# EasyEDA Pro project ProPrj_super_cap_ctrl_v1.0_2025-02-24.epro, board PCB1
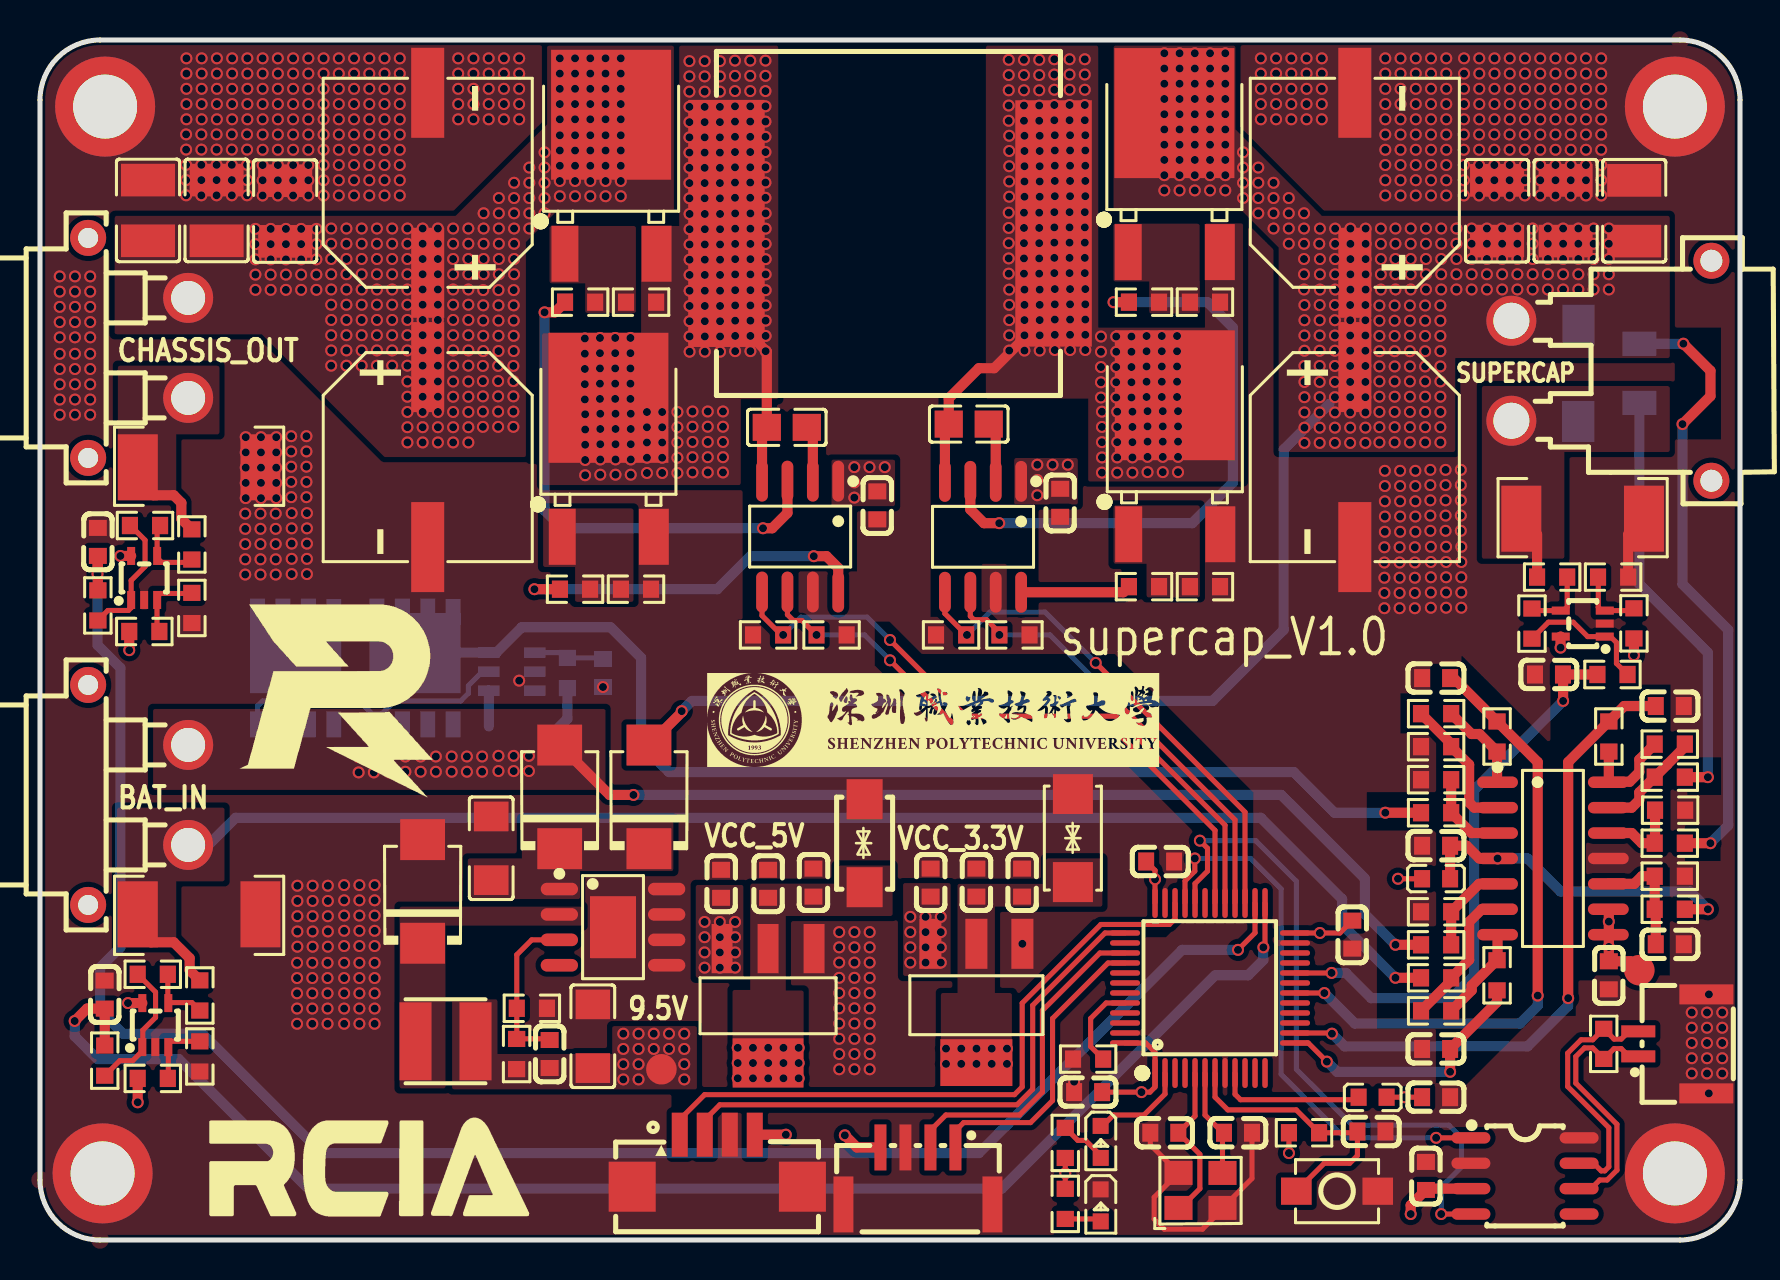
[diagram p8: board, top side]
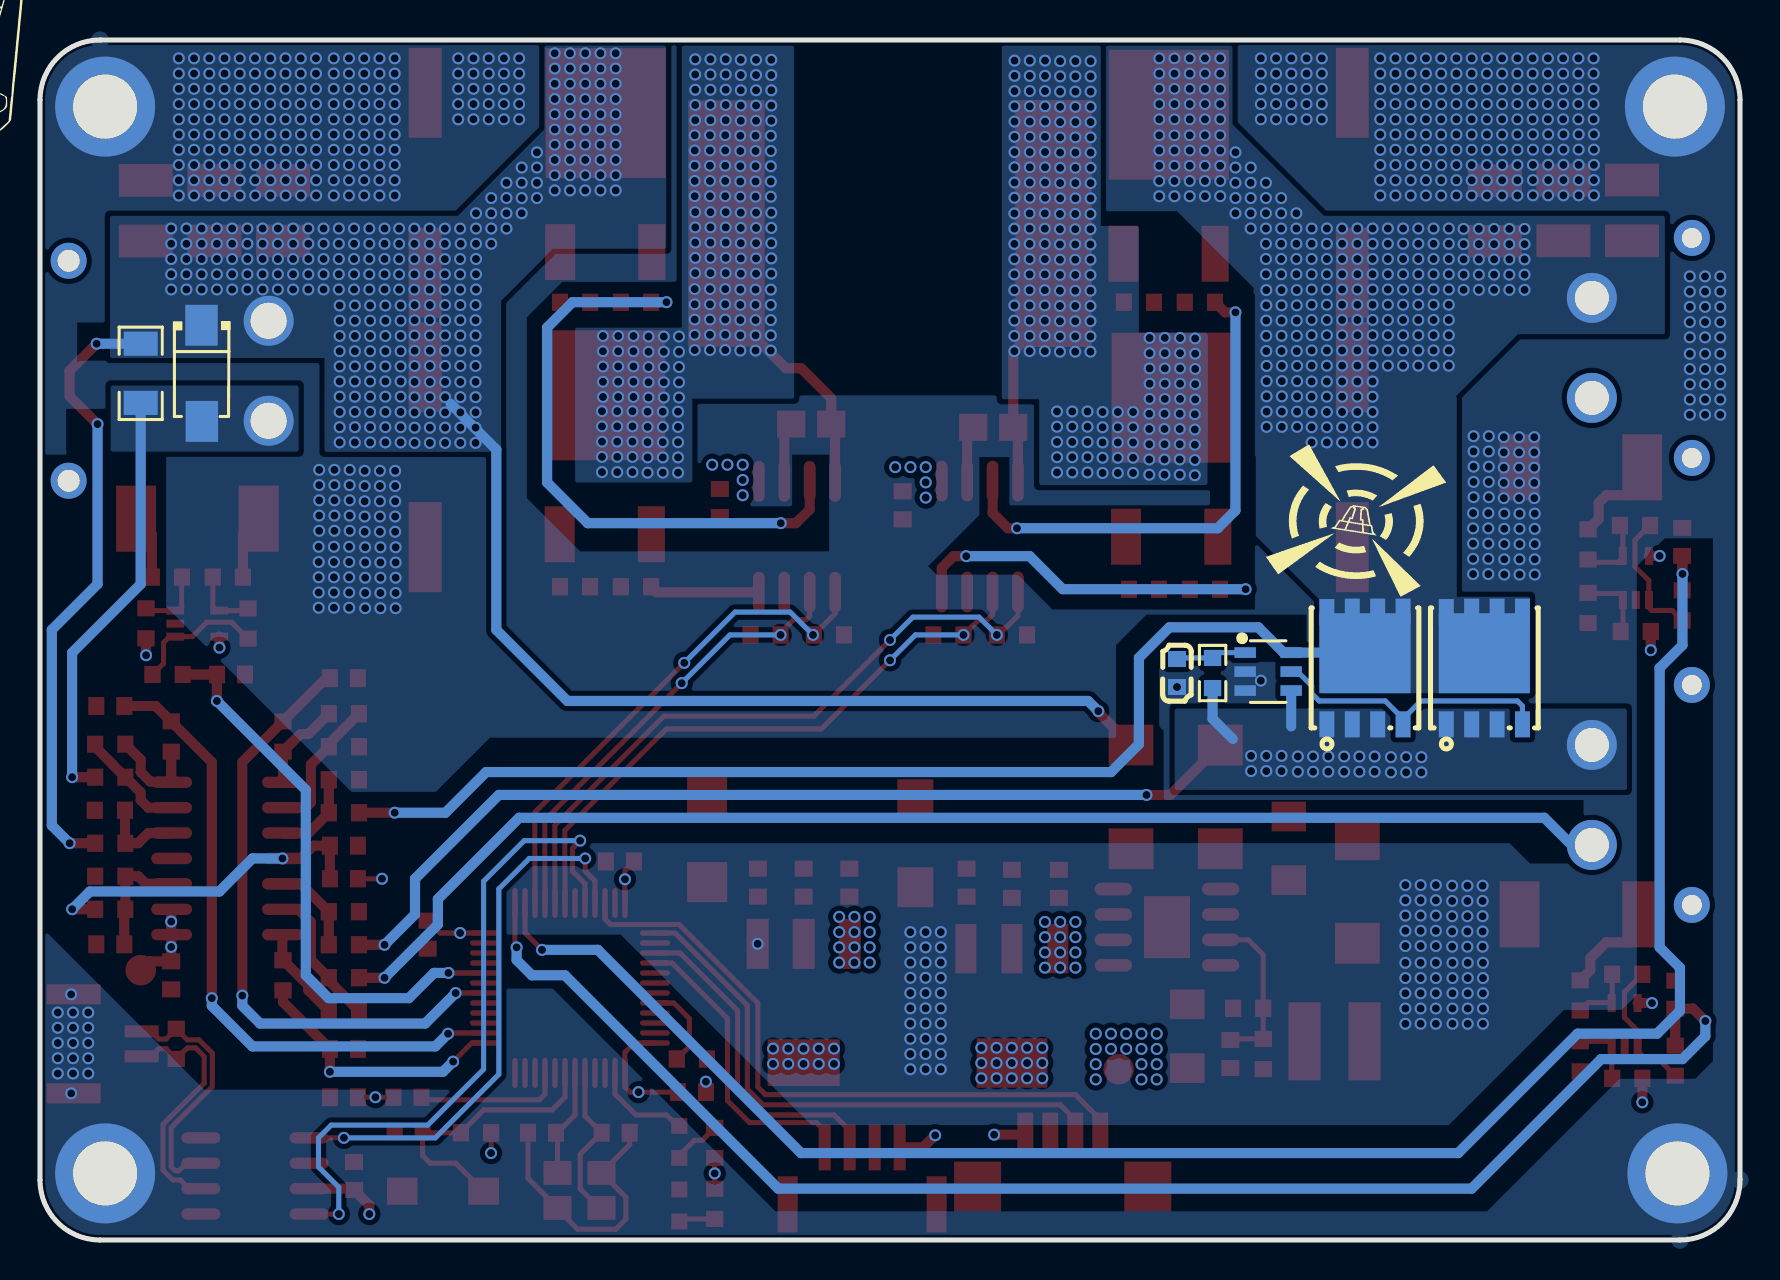
[diagram p9: board, bottom side, seen from below]

Outline 85 x 60 mm; copper layers: Top Layer, GND, VCC, Bottom Layer. Coordinates in mm from the lower left corner of the outline.
Outline path: 0,57 arc(0.88,59.12) 3,60 82,60 arc(84.12,59.12) 85,57 85,3 arc(84.12,0.88) 82,0 3,0 arc(0.88,0.88) 0,3 0,57
Stack: Top Layer 0.035mm 外层铜厚1oz / Dielectric1 0.2104mm 7628 RC49% 8.6mil / GND 0.0152mm 内层铜厚 / Dielectric2 1.065mm 1.1mm H/HOZ 含铜 / VCC 0.0152mm 内层铜厚 / Dielectric3 0.2104mm 7628 RC49% 8.6mil / Bottom Layer 0.035mm 外层铜厚1oz

## Design rules (mm)
net CAN-H: DP1
net CAN-L: DP1
template: 自定义配置
spacing copperThickness1oz (default): track to track 0.102, other pairs 0.076 to 0.3
spacing copperThickness2oz: track to track 0.203, other pairs 0.152 to 0.3
track width copperThickness1oz (default): min 0.127, default 0.254, max 2.54
track width copperThickness2oz: min 0.203, default 0.254, max 2.54
differential pair differentialPair (default): width min 0.127, default 0.254, max 2.54; gap min 0.152, default 0.152
via viaSize (default): diameter min 0.399, default 0.599, max 10; hole min 0.249, default 0.399, max 6.299

## Placement (name value [footprint] x y rotation side)
C1  10uF  [C0603]  41.87 36.73 90 top
C2  1uF  [C0805]  37.34 40.63 0 top
C3  150uF  [CAP-SMD_BD10.0-L10.3-W10.3-LS11.3-FD]  19.39 39.14 270 top
C4  150uF  [CAP-SMD_BD10.0-L10.3-W10.3-LS11.3-FD]  19.39 52.86 90 top
C7  47uF  [C1210]  12.26 51.45 270 top
C8  47uF  [C1210]  8.83 51.48 270 top
C9  47uF  [C1210]  5.4 51.48 270 top
C10  150uF  [CAP-SMD_BD10.0-L10.3-W10.3-LS11.3-FD]  65.74 39.14 270 top
C11  150uF  [CAP-SMD_BD10.0-L10.3-W10.3-LS11.3-FD]  65.74 52.86 90 top
C12  47uF  [C1210]  72.85 51.46 270 top
C13  47uF  [C1210]  76.28 51.46 270 top
C14  47uF  [C1210]  79.71 51.46 270 top
C15  10uF  [C0603]  51.01 36.86 90 top
C16  1uF  [C0805]  46.44 40.8 0 top
C17  22pF  [C0603]  56.22 5.36 180 top
C18  22pF  [C0603]  59.9 5.36 0 top
C19  100nF  [C0603]  66.57 5.42 0 top
C54  100nF  [C0603]  69.3 3.2 90 top
C170  100nF  [C0603]  52.41 7.39 0 top
C171  100nF  [C0603]  56.01 18.93 180 top
C174  100nF  [C0603]  65.61 15.27 90 top
C175  100nF  [C0603]  69.81 7.14 0 top
C176  100nF  [C0603]  69.81 19.71 0 top
C177  10nF  [C0603]  2.89 34.9 270 top
C178  10nF  [C0603]  69.81 28.1 0 top
C179  10nF  [C0603]  81.49 26.7 180 top
C180  100nF  [C0603]  81.49 14.79 180 top
C181  100nF  [C0603]  78.44 13.24 90 top
C182  10nF  [C0603]  75.45 28.28 0 top
C184  10nF  [C0603]  3.24 12.27 270 top
C185  10uF  [C1206]  22.56 19.59 90 top
C186  100nF  [C0603]  36.4 17.81 270 top
C187  47uF  [C1206]  27.64 10.19 270 top
C188  100nF  [C0603]  34.06 17.81 270 top
C189  100nF  [C0603]  44.53 17.87 270 top
C190  10uF  [C0603]  38.67 17.87 270 top
C191  100nF  [C0603]  46.82 17.87 270 top
C192  10uF  [C0603]  49.1 17.87 270 top
C194  10nF  [C0603]  69.81 9.55 0 top
C195  100nF  [C0603]  28.15 28.35 90 bottom
CN1  HC-1.25-4PWT  [CONN-SMD_4P-P1.25-HC-1.25-4PWT]  33.86 3.97 0 top
CN2  XT30PW-M  [CONN-TH_XT30PW-M]  78.57 43.46 90 top
D1  SS510  [SMB_L4.3-W3.6-LS5.4-RD]  19.13 17.43 90 top
D2  SMAJ5.0CA  [SMA_L4.4-W2.8-LS5.1-BI]  41.23 19.84 270 top
D3  SMAJ3.3CA  [SMA_L4.3-W2.6-LS5.1-BI]  51.64 20.09 270 top
D4  SMAJ75A  [SMA_L4.3-W2.6-LS5.0-RD]  76.92 43.34 270 bottom
D5  SS510  [SMB_L4.3-W3.6-LS5.4-RD]  25.98 22.16 90 top
D6  SS510  [SMB_L4.3-W3.6-LS5.4-RD]  30.45 22.16 90 top
L1  22uH  [IND-SMD_L17.2-W17.2]  42.5 50.83 0 top
L2  10uH  [L0603]  66.63 7.14 180 top
L3  10uH  [L0603]  69.81 18.06 0 top
L4  100uH  [IND-SMD_L4.0-W4.0_FNR40XXS]  20.28 9.93 180 top
LED1  -  [LED_0603]  53.04 4.85 270 top
LED2  -  [LED_0603]  53.04 1.68 270 top
NOREF  -  [Pad_ie150]  3.13 3.33 0 top
NOREF#2  -  [Pad_e1701]  79.97 13.49 0 top
NOREF#3  -  [Pad_ie149]  81.74 3.33 0 top
NOREF#4  -  [Pad_e11324]  31.07 8.54 0 top
NOREF#5  -  [Pad_ie148]  81.74 56.67 0 top
NOREF#6  -  [Pad_ie145]  3.26 56.67 0 top
Q1  NCEP0178AK  [TO-252-2_L6.5-W6.1-P4.58-LS10.0-TL]  28.54 52.79 90 top
Q2  NCEP0178AK  [TO-252-2_L6.5-W6.1-P4.58-LS10.0-TL]  28.4 38.64 90 top
Q3  NCEP0178AK  [TO-252-2_L6.5-W6.1-P4.58-LS10.0-TL]  56.7 52.87 90 top
Q4  NCEP0178AK  [TO-252-2_L6.5-W6.1-P4.58-LS10.0-TL]  56.72 38.76 90 top
Q7  BSC030N08NS5  [PG-TDSON-8_L5.0-W6.0-P1.27-BL-EP]  12.78 28.6 180 bottom
Q8  BSC030N08NS5  [PG-TDSON-8_L5.0-W6.0-P1.27-BL-EP]  18.75 28.6 180 bottom
R1  10K  [R0603]  30.05 46.89 180 top
R2  4.7R  [R0603]  27.01 46.89 180 top
R3  10K  [R0603]  29.8 32.54 180 top
R4  4.7R  [R0603]  26.75 32.54 180 top
R5  10K  [R0603]  58.25 46.89 180 top
R6  4.7R  [R0603]  55.2 46.89 180 top
R7  10K  [R0603]  58.25 32.67 180 top
R8  4.7R  [R0603]  55.2 32.67 180 top
R9  10K  [R0603]  39.58 30.25 180 top
R10  10K  [R0603]  36.4 30.25 0 top
R11  10K  [R0603]  48.72 30.25 180 top
R12  10K  [R0603]  45.55 30.25 0 top
R13  10K  [R0603]  63.2 5.36 180 top
R14  10K  [R0603]  51.26 1.81 270 top
R15  10K  [R0603]  51.26 4.85 90 top
R16  10K  [R0603]  52.41 9.05 0 top
R108  1K  [R0603]  7.59 31.6 90 top
R109  1K  [R0603]  7.59 34.78 270 top
R110  1K  [R0603]  2.89 31.73 90 top
R111  7.5k  [R0603]  5.25 35.72 180 top
R112  7.5K  [R0603]  5.21 30.43 180 top
R113  15K  [R0603]  69.81 21.36 0 top
R114  15K  [R0603]  69.81 24.67 0 top
R115  1K  [R0603]  69.81 23.02 180 top
R116  1K  [R0603]  69.81 26.32 180 top
R117  1K  [R0603]  72.85 25.17 270 top
R118  15K  [R0603]  81.49 19.84 180 top
R119  15K  [R0603]  81.49 23.14 180 top
R120  1K  [R0603]  81.5 21.49 0 top
R121  1K  [R0603]  81.49 24.79 0 top
R122  1K  [R0603]  78.44 25.17 270 top
R123  10K  [R0603]  81.49 16.54 180 top
R124  10K  [R0603]  81.49 18.19 180 top
R125  1K  [R0603]  78.66 33.15 180 top
R126  1K  [R0603]  75.61 33.15 0 top
R127  13.3K  [R0603]  78.62 28.28 180 top
R128  7.5k  [R0603]  74.6 30.82 270 top
R129  7.5K  [R0603]  79.7 30.83 270 top
R135  1K  [R0603]  7.99 9.18 90 top
R136  1K  [R0603]  7.99 12.23 270 top
R137  13.3K  [R0603]  3.24 8.97 90 top
R138  7.5k  [R0603]  5.64 13.29 180 top
R139  7.5K  [R0603]  5.64 8.08 180 top
R140  30K  [R0603]  23.83 9.3 270 top
R141  4.7K  [R0603]  24.59 11.59 180 top
R145  1K  [R0603]  69.81 16.41 0 top
R146  15K  [R0603]  69.81 14.76 0 top
R147  15K  [R0603]  69.81 13.11 0 top
R148  1K  [R0603]  69.81 11.46 0 top
R149  1K  [R0603]  72.85 13.24 270 top
R150  120R  [R0603]  78.19 9.81 90 top
R151  10mΩ  [RES-SMD_L6.4-W3.2-R2512]  77.13 36.07 0 top
R152  20K  [R1206]  79.97 43.34 90 bottom
R153  10mΩ  [RES-SMD_L6.4-W3.2-R2512]  7.96 38.64 0 top
R154  47R  [R0603]  26.37 28.35 270 bottom
R155  10mΩ  [RES-SMD_L6.4-W3.2-R2512]  7.96 16.28 180 top
SW1  轻触按键3*4*H  [SW-SMD_L4.0-W2.9-LS5.0]  64.85 2.44 180 top
U2  UCC27211D  [SOIC-8_L4.9-W3.9-P1.27-LS6.0-BL]  38.01 35.17 180 top
U3  UCC27211D  [SOIC-8_L4.9-W3.9-P1.27-LS6.0-BL]  47.15 35.16 180 top
U4  STM32F334C8T6  [LQFP-48_L7.0-W7.0-P0.50-LS9.0-BL]  58.5 12.6 0 top
U5  GH1.25-4P卧贴  [CONN-SMD_4P-P1.25_GH1.25-4P]  43.9 3.2 0 top
U10  -  [SOIC-8_L5.0-W4.0-P1.27-LS6.0-BL]  74.25 3.2 270 top
U11  GH1.25-2P卧贴  [CONN-SMD_2P-P1.25_GH1.25-2P]  81.62 9.81 90 top
U18  XL7005A  [SOIC-8_L4.9-W3.9-P1.27-LS6.0-BL-EP3.1-1]  28.65 15.64 270 top
U19  33nF  [C0603]  25.48 9.3 270 top
U20  AMS1117-5.0  [SOT-223_L6.5-W3.5-P2.30-LS7.0-BR]  36.4 11.71 90 top
U21  AMS1117-3.3  [SOT-223-3_L6.5-W3.4-P2.30-LS7.0-BR]  46.82 11.84 90 top
U25  TLV521DCKR  [SC-70-5_L2.1-W1.3-P0.65-LS2.1-BR]  77.14 30.82 0 top
U26  TLV521DCKR  [SC-70-5_L2.1-W1.3-P0.65-LS2.1-BR]  5.77 10.75 270 top
U27  TLV521DCKR  [SC-70-5_L2.1-W1.3-P0.65-LS2.1-BR]  5.21 33.1 270 top
U30  LM5050Q0MK-1/NOPB  [SOT-23-6_L2.9-W1.6-P0.95-LS2.8-BL]  23.59 28.42 270 bottom
U31  TLV2374MDREP  [SOIC-14_L8.7-W3.9-P1.27-LS6.0-BL]  75.65 19.08 270 top
U32  XT30PW-F  [CONN-TH_XT30PW-F-1]  4.91 22.25 270 top
U33  XT30PW-F  [CONN-TH_XT30PW-F-1]  4.91 44.61 270 top
X2  8MHz  [OSC-SMD_4P-L3.2-W2.5-BL]  58.02 2.48 0 top

## Footprints (pads in the part's own frame, mm; a bottom-side part is the same pattern mirrored in y, then rotated)
C0603
  rect 0.8x0.9 smd: 1(-0.7,0) 2(0.7,0)
C0805
  rect 1.41x1.35 smd: 1(-1,0) 2(1,0)
C1206
  rect 1.485x1.728 smd: 1(-1.593,0) 2(1.593,0)
C1210
  rect 1.635x2.7 smd: 1(-1.518,0) 2(1.518,0)
CAP-SMD_BD10.0-L10.3-W10.3-LS11.3-FD
  rect 4.5x1.65 smd: 1(-4.5,0) 2(4.5,0)
CONN-SMD_2P-P1.25_GH1.25-2P
  rect 0.6x1.7 smd: 1(-0.625,1.702) 2(0.625,1.702)
  rect 1x2.7 smd: 3(2.475,-1.702) 4(-2.475,-1.698)
CONN-SMD_4P-P1.25-HC-1.25-4PWT
  rect 0.8x2.2 smd: 1(-1.875,1.3) 2(-0.625,1.3) 3(0.625,1.3) 4(1.875,1.3)
  rect 2.35x2.5 smd: 5(4.255,-1.3) 6(-4.255,-1.3)
CONN-SMD_4P-P1.25_GH1.25-4P
  rect 0.6x2.3 smd: 1(1.875,1.425) 2(0.625,1.425) 3(-0.625,1.425) 4(-1.875,1.425)
  rect 1x2.8 smd: 5(-3.725,-1.425) 6(3.725,-1.425)
CONN-TH_XT30PW-F-1
  round 2.5 hole 1.7: 1(-2.5,2.5) 2(2.5,2.5)
  round 1.8 hole 1: 3(5.5,-2.5) 4(-5.5,-2.5)
CONN-TH_XT30PW-M
  round 2.5 hole 1.8: 1(-2.5,5) 2(2.5,5)
  round 1.8 hole 1.1: 3(5.5,-5) 4(-5.5,-5)
IND-SMD_L4.0-W4.0_FNR40XXS
  rect 1.6x3.9 smd: 1(-1.5,0) 2(1.5,0)
IND-SMD_L17.2-W17.2
  rect 3.825x12.35 smd: 1(-8.178,0)
  rect 3.825x12.32 smd: 2(8.178,0)
L0603
  rect 0.8x0.864 smd: 1(-0.7,0) 2(0.7,0)
LED_0603
  rect 0.8x0.8 smd: 1(-0.851,-0.01) 2(0.75,-0.005)
LQFP-48_L7.0-W7.0-P0.50-LS9.0-BL
  oval 0.27x1.5 smd: 1(-2.75,-4.25) 2(-2.25,-4.25) 3(-1.75,-4.25) 4(-1.25,-4.25) 5(-0.75,-4.25) 6(-0.25,-4.25) 7(0.25,-4.25) 8(0.75,-4.25) 9(1.25,-4.25) 10(1.75,-4.25) 11(2.25,-4.25) 12(2.75,-4.25) 25(2.75,4.25) 26(2.25,4.25) 27(1.75,4.25) 28(1.25,4.25) 29(0.75,4.25) 30(0.25,4.25) 31(-0.25,4.25) 32(-0.75,4.25) 33(-1.25,4.25) 34(-1.75,4.25) 35(-2.25,4.25) 36(-2.75,4.25)
  oval 1.5x0.27 smd: 13(4.25,-2.75) 14(4.25,-2.25) 15(4.25,-1.75) 16(4.25,-1.25) 17(4.25,-0.75) 18(4.25,-0.25) 19(4.25,0.25) 20(4.25,0.75) 21(4.25,1.25) 22(4.25,1.75) 23(4.25,2.25) 24(4.25,2.75) 37(-4.25,2.75) 38(-4.25,2.25) 39(-4.25,1.75) 40(-4.25,1.25) 41(-4.25,0.75) 42(-4.25,0.25) 43(-4.25,-0.25) 44(-4.25,-0.75) 45(-4.25,-1.25) 46(-4.25,-1.75) 47(-4.25,-2.25) 48(-4.25,-2.75)
OSC-SMD_4P-L3.2-W2.5-BL
  rect 1.4x1.2 smd: 1(-1.1,-0.875) 2(1.1,-0.875) 3(1.1,0.875) 4(-1.1,0.875)
Pad_e1701
  round 1.524 smd: 49(0,0)
Pad_e11324
  round 1.524 smd: 49(0,0)
Pad_ie145
  round 5 hole 3.2: 10(0,0)
Pad_ie148
  round 5 hole 3.2: 10(0,0)
Pad_ie149
  round 5 hole 3.2: 10(0,0)
Pad_ie150
  round 5 hole 3.2: 10(0,0)
PG-TDSON-8_L5.0-W6.0-P1.27-BL-EP
  rect 0.75x1.3 smd: 1(-1.905,-2.82) 2(-0.635,-2.82) 3(0.635,-2.82) 4(1.905,-2.82) 5(1.905,2.82) 6(0.635,2.82) 7(-0.635,2.82) 8(-1.905,2.794)
  rect 4.56x4 smd: 8(0,0.737)
R0603
  rect 0.806x0.864 smd: 1(-0.753,0) 2(0.753,0)
R1206
  rect 1.208x1.701 smd: 1(-1.479,0) 2(1.479,0)
RES-SMD_L6.4-W3.2-R2512
  rect 2x3.3 smd: 1(-3.067,0) 2(3.067,0)
SC-70-5_L2.1-W1.3-P0.65-LS2.1-BR
  rect 0.9x0.4 smd: 1(1.1,-0.65) 2(1.1,0) 3(1.1,0.65) 4(-1.1,0.65) 5(-1.1,-0.65)
SMA_L4.3-W2.6-LS5.0-RD
  rect 2.046x1.62 smd: 1(-2.404,-0.009) 2(2.404,0.009)
SMA_L4.3-W2.6-LS5.1-BI
  rect 2x2 smd: 1(-2.2,0) 2(2.2,0)
SMA_L4.4-W2.8-LS5.1-BI
  rect 2x1.8 smd: 1(-2.2,0) 2(2.2,0)
SMB_L4.3-W3.6-LS5.4-RD
  rect 2.047x2.241 smd: 1(-2.591,0) 2(2.591,0)
SOIC-8_L4.9-W3.9-P1.27-LS6.0-BL
  oval 0.588x2.045 smd: 1(-1.905,-2.772) 2(-0.635,-2.772) 3(0.635,-2.772) 4(1.905,-2.772) 5(1.905,2.772) 6(0.635,2.772) 7(-0.635,2.772) 8(-1.905,2.772)
SOIC-8_L4.9-W3.9-P1.27-LS6.0-BL-EP3.1-1
  oval 0.63x1.865 smd: 1(-1.905,-2.683) 2(-0.635,-2.683) 3(0.635,-2.683) 4(1.905,-2.683) 5(1.905,2.683) 6(0.635,2.683) 7(-0.635,2.683) 8(-1.905,2.683)
  rect 3.1x2.3 smd: 9(0,0)
SOIC-8_L5.0-W4.0-P1.27-LS6.0-BL
  oval 0.569x1.95 smd: 1(-1.905,-2.705) 2(-0.635,-2.705) 3(0.635,-2.705) 4(1.905,-2.705) 5(1.905,2.705) 6(0.635,2.705) 7(-0.635,2.705) 8(-1.905,2.705)
SOIC-14_L8.7-W3.9-P1.27-LS6.0-BL
  oval 0.574x2.038 smd: 1(-3.81,-2.769) 2(-2.54,-2.769) 3(-1.27,-2.769) 4(0,-2.769) 5(1.27,-2.769) 6(2.54,-2.769) 7(3.81,-2.769) 8(3.81,2.769) 9(2.54,2.769) 10(1.27,2.769) 11(0,2.769) 12(-1.27,2.769) 13(-2.54,2.769) 14(-3.81,2.769)
SOT-23-6_L2.9-W1.6-P0.95-LS2.8-BL
  rect 0.532x1.072 smd: 1(-0.95,-1.149) 2(0,-1.149) 3(0.95,-1.149) 4(0.95,1.149) 5(0,1.149) 6(-0.95,1.149)
SOT-223-3_L6.5-W3.4-P2.30-LS7.0-BR
  rect 2.5x1.1 smd: 1(2.97,-2.3) 2(2.97,0) 3(2.97,2.3)
  rect 2.34x3.6 smd: 4(-2.97,0)
SOT-223_L6.5-W3.5-P2.30-LS7.0-BR
  rect 2.465x1.05 smd: 1(2.857,-2.3) 2(2.857,0) 3(2.857,2.3)
  rect 2.465x3.54 smd: 4(-2.857,0)
SW-SMD_L4.0-W2.9-LS5.0
  rect 1.53x1.36 smd: 1(-2.035,0) 2(2.035,0)
TO-252-2_L6.5-W6.1-P4.58-LS10.0-TL
  rect 2.8x1.35 smd: 1(-3.475,2.29)
  rect 2.8x1.5 smd: 3(-3.475,-2.29)
  rect 6.5x6 smd: 4(3.475,-0.017)

## Nets
As in the schematic, except:
GND: C1.1 C3.2 C4.2 C7.1 C8.1 C9.1 C10.2 C11.2 C12.1 C13.1 C14.1 C15.1 C17.2 C18.2 C19.2 C54.2 C170.1 C171.1 C174.1 C175.2 C176.1 C177.1 C178.1 C179.1 C180.1 C181.1 C182.1 C184.1 C185.2 C186.1 C187.1 C188.1 C189.1 C190.1 C191.1 C192.1 C194.1 C195.1 CN1.3 CN1.5 CN1.6 D1.2 D2.1 D3.1 LED2.1 NOREF.10 NOREF#3.10 NOREF#5.10 NOREF#6.10 Q2.3 Q4.3 R3.1 R7.1 R9.1 R10.1 R11.1 R12.1 R16.1 R108.1 R114.1 R115.2 R120.2 R124.1 R125.1 R135.1 R141.1 R145.1 R151.2 R153.2 R155.1 SW1.1 U2.7 U3.7 U4.8 U4.23 U4.35 U4.47 U5.3 U5.5 U5.6 U10.2 U10.8 U11.3 U11.4 U18.5 U18.6 U18.7 U18.8 U18.9 U20.1 U21.1 U25.2 U26.2 U27.2 U30.2 U30.3 U31.11 X2.2 X2.4
VCC_1.65V_OPAMP: C181.2 NOREF#2.49 R112.2 R129.2 R139.2 U31.8 U31.9
VCC_9.5V: C1.2 C15.2 C187.2 C188.2 C189.2 L4.1 NOREF#4.49 R140.2 U2.1 U3.1 U19.2 U20.3 U21.3
V_CAP_DETC(PA4): U4.14
V_CAP_DETC(PB0): C179.2 R122.1
V_CHASIS_DETC(PA4): C178.2 R117.1
V_CHASIS_DETC(PB0): U4.18

Pads without a net: CN2 3 4; U4 3 4 10 11 12 15 16 17 19 21 22 31 38 41 42 43 45 46; U10 5; U18 4; U32 3 4; U33 3 4

## Via types
v1: diameter 0.6, hole 0.4, Top Layer to Bottom Layer, 1659 vias

## Routing (per net, layer and track width the routed paths; a pad name or vN(x,y) marks a point on that pad's centre or on a via; arc(x,y) is an arc through that point)
GND: length 17.1
  Top Layer w0.254: C18.2 60.6,3.08 X2.2 59.12,1.54 58.13,0.54 56.21,0.54 55.71,1.04 55.71,2.14 X2.4 55.52,4.76 C17.2
  Top Layer w0.508: 80.2,36.07 79.41,35.28 R125.1
  vias: v1(0.99,48.18) v1(0.99,47.42) v1(0.99,46.66) v1(0.99,45.89) v1(0.99,45.13) v1(0.99,44.31) v1(0.99,43.55) v1(0.99,42.79) v1(0.99,42.02) v1(0.99,41.26) v1(1.75,48.18) v1(1.75,47.42) v1(1.75,46.66) v1(1.75,45.89) v1(1.75,45.13) v1(1.75,44.31) v1(1.75,43.55) v1(1.75,42.79) v1(1.75,42.02) v1(1.75,41.26) v1(2.51,48.18) v1(2.51,47.42) v1(2.51,46.66) v1(2.51,45.89) v1(2.51,45.13) v1(2.51,44.31) v1(2.51,43.55) v1(2.51,42.79) v1(2.51,42.02) v1(2.51,41.26) v1(7.32,59.08) v1(7.32,58.32) v1(7.32,57.56) v1(7.32,56.8) v1(7.32,56.04) v1(7.31,55.28) v1(7.31,54.52) v1(7.31,53.76) v1(7.31,53) v1(7.31,52.23) v1(8.08,59.08) v1(8.08,58.32) v1(8.08,57.56) v1(8.08,56.8) v1(8.08,56.04) v1(8.07,55.28) v1(8.07,54.52) v1(8.07,53.76) v1(8.07,53) v1(8.07,52.23) v1(8.84,59.08) v1(8.84,58.32) v1(8.84,57.56) v1(8.84,56.8) v1(8.84,56.04) v1(8.83,55.28) v1(8.83,54.52) v1(8.83,53.76) v1(8.83,53) v1(8.83,52.23) v1(9.61,59.08) v1(9.61,58.32) v1(9.61,57.56) v1(9.61,56.8) v1(9.61,56.04) v1(9.59,55.28) v1(9.59,54.52) v1(9.59,53.76) v1(9.59,53) v1(9.59,52.23) v1(10.29,40.14) v1(10.29,39.38) v1(10.29,38.62) v1(10.29,37.86) v1(10.29,37.09) v1(10.26,36.32) v1(10.26,35.56) v1(10.26,34.8) v1(10.26,34.03) v1(10.26,33.27) v1(10.37,59.08) v1(10.37,58.32) v1(10.37,57.56) v1(10.37,56.8) v1(10.37,56.04) v1(10.35,55.28) v1(10.35,54.52) v1(10.35,53.76) v1(10.35,53) v1(10.35,52.23) v1(11.05,40.14) v1(11.05,39.38) v1(11.05,38.62) v1(11.05,37.86) v1(11.05,37.09) v1(11.02,36.32) v1(11.02,35.56) v1(11.02,34.8) v1(11.02,34.03) v1(11.02,33.27) v1(11.13,59.08) v1(11.13,58.32) v1(11.13,57.56) v1(11.13,56.8) v1(11.13,56.04) v1(11.13,55.27) v1(11.13,54.51) v1(11.13,53.75) v1(11.13,52.99) v1(11.13,52.23) v1(11.81,40.14) v1(11.81,39.38) v1(11.81,38.62) v1(11.81,37.86) v1(11.81,37.09) v1(11.79,36.32) v1(11.79,35.56) v1(11.79,34.8) v1(11.79,34.03) v1(11.79,33.27) v1(11.89,59.08) v1(11.89,58.32) v1(11.89,57.56) v1(11.89,56.8) v1(11.89,56.04) v1(11.89,55.27) v1(11.89,54.51) v1(11.89,53.75) v1(11.89,52.99) v1(11.89,52.23) v1(12.56,40.19) v1(12.56,39.43) v1(12.56,38.67) v1(12.56,37.9) v1(12.56,37.14) v1(12.58,36.34) v1(12.58,35.58) v1(12.58,34.82) v1(12.58,34.06) v1(12.58,33.3) v1(12.66,59.08) v1(12.66,58.32) v1(12.66,57.56) v1(12.66,56.8) v1(12.66,56.04) v1(12.66,55.27) v1(12.66,54.51) v1(12.66,53.75) v1(12.66,52.99) v1(12.66,52.23) v1(12.87,17.71) v1(12.87,16.95) v1(12.87,16.19) v1(12.87,15.43) v1(12.87,14.67) v1(12.85,13.86) v1(12.85,13.1) v1(12.85,12.34) v1(12.85,11.57) v1(12.85,10.81) v1(13.32,40.19) v1(13.32,39.43) v1(13.32,38.67) v1(13.32,37.9) v1(13.32,37.14) v1(13.35,36.34) v1(13.35,35.58) v1(13.35,34.82) v1(13.35,34.06) v1(13.35,33.3) v1(13.42,59.08) v1(13.42,58.32) v1(13.42,57.56) v1(13.42,56.8) v1(13.42,56.04) v1(13.42,55.27) v1(13.42,54.51) v1(13.42,53.75) v1(13.42,52.99) v1(13.42,52.23) v1(13.63,17.71) v1(13.63,16.95) v1(13.63,16.19) v1(13.63,15.43) v1(13.63,14.67) v1(13.61,13.86) v1(13.61,13.1) v1(13.61,12.34) v1(13.61,11.57) v1(13.61,10.81) v1(14.18,59.08) v1(14.18,58.32) v1(14.18,57.56) v1(14.18,56.8) v1(14.18,56.04) v1(14.18,55.27) v1(14.18,54.51) v1(14.18,53.75) v1(14.18,52.99) v1(14.18,52.23) v1(14.39,17.71) v1(14.39,16.95) v1(14.39,16.19) v1(14.39,15.43) v1(14.39,14.67) v1(14.38,13.86) v1(14.38,13.1) v1(14.38,12.34) v1(14.38,11.57) v1(14.38,10.81) v1(14.94,59.08) v1(14.94,58.32) v1(14.94,57.56) v1(14.94,56.8) v1(14.94,56.04) v1(14.94,55.27) v1(14.94,54.51) v1(14.94,53.75) v1(14.94,52.99) v1(14.94,52.23) v1(15.21,17.75) v1(15.21,16.98) v1(15.21,16.22) v1(15.21,15.46) v1(15.21,14.7) v1(15.21,13.86) v1(15.21,13.1) v1(15.21,12.34) v1(15.21,11.57) v1(15.21,10.81) v1(15.7,59.08) v1(15.7,58.32) v1(15.7,57.56) v1(15.7,56.8) v1(15.7,56.04) v1(15.7,55.27) v1(15.7,54.51) v1(15.7,53.75) v1(15.7,52.99) v1(15.7,52.23) v1(15.97,17.75) v1(15.97,16.98) v1(15.97,16.22) v1(15.97,15.46) v1(15.97,14.7) v1(15.97,13.86) v1(15.97,13.1) v1(15.97,12.34) v1(15.97,11.57) v1(15.97,10.81) v1(16.47,59.08) v1(16.47,58.32) v1(16.47,57.56) v1(16.47,56.8) v1(16.47,56.04) v1(16.47,55.27) v1(16.47,54.51) v1(16.47,53.75) v1(16.47,52.99) v1(16.47,52.23) v1(16.73,17.75) v1(16.73,16.98) v1(16.73,16.22) v1(16.73,15.46) v1(16.73,14.7) v1(16.73,13.86) v1(16.73,13.1) v1(16.73,12.34) v1(16.73,11.57) v1(16.73,10.81) v1(17.23,59.08) v1(17.23,58.32) v1(17.23,57.56) v1(17.23,56.8) v1(17.23,56.04) v1(17.23,55.27) v1(17.23,54.51) v1(17.23,53.75) v1(17.23,52.99) v1(17.23,52.23) v1(17.99,59.08) v1(17.99,58.32) v1(17.99,57.56) v1(17.99,56.8) v1(17.99,56.04) v1(17.99,55.27) v1(17.99,54.51) v1(17.99,53.75) v1(17.99,52.99) v1(17.99,52.23) v1(20.91,59.08) v1(20.91,58.32) v1(20.91,57.56) v1(20.91,56.8) v1(20.91,56.04) v1(21.67,59.08) v1(21.67,58.32) v1(21.67,57.56) v1(21.67,56.8) v1(21.67,56.04) v1(22.43,59.08) v1(22.43,58.32) v1(22.43,57.56) v1(22.43,56.8) v1(22.43,56.04) v1(23.2,59.08) v1(23.2,58.32) v1(23.2,57.56) v1(23.2,56.8) v1(23.2,56.04) v1(23.96,59.08) v1(23.96,58.32) v1(23.96,57.56) v1(23.96,56.8) v1(23.96,56.04) v1(23.96,27.97) v1(28.15,27.65) v1(39.96,15.4) v1(39.96,14.63) v1(39.96,13.87) v1(39.96,13.11) v1(39.96,12.35) v1(39.96,11.59) v1(39.96,10.82) v1(39.96,10.06) v1(39.96,9.3) v1(39.96,8.54) v1(40.72,15.4) v1(40.72,14.63) v1(40.72,13.87) v1(40.72,13.11) v1(40.72,12.35) v1(40.72,11.59) v1(40.72,10.82) v1(40.72,10.06) v1(40.72,9.3) v1(40.72,8.54) v1(41.48,15.4) v1(41.48,14.63) v1(41.48,13.87) v1(41.48,13.11) v1(41.48,12.35) v1(41.48,11.59) v1(41.48,10.82) v1(41.48,10.06) v1(41.48,9.3) v1(41.48,8.54) v1(49.12,14.81) v1(51.71,7.92) v1(61.04,59.08) v1(61.04,58.32) v1(61.04,57.56) v1(61.04,56.8) v1(61.04,56.04) v1(61.8,59.08) v1(61.8,58.32) v1(61.8,57.56) v1(61.8,56.8) v1(61.8,56.04) v1(62.57,59.08) v1(62.57,58.32) v1(62.57,57.56) v1(62.57,56.8) v1(62.57,56.04) v1(63.33,59.08) v1(63.33,58.32) v1(63.33,57.56) v1(63.33,56.8) v1(63.33,56.04) v1(64.09,59.08) v1(64.09,58.32) v1(64.09,57.56) v1(64.09,56.8) v1(64.09,56.04) v1(67.24,38.46) v1(67.24,37.7) v1(67.24,36.94) v1(67.24,36.17) v1(67.24,35.41) v1(67.22,34.64) v1(67.22,33.88) v1(67.22,33.11) v1(67.22,32.35) v1(67.22,31.59) v1(67.26,59.08) v1(67.26,58.32) v1(67.26,57.56) v1(67.26,56.8) v1(67.26,56.04) v1(67.26,55.27) v1(67.26,54.51) v1(67.26,53.75) v1(67.26,52.99) v1(67.26,52.23) v1(68.03,59.08) v1(68.03,58.32) v1(68.03,57.56) v1(68.03,56.8) v1(68.03,56.04) v1(68.03,55.27) v1(68.03,54.51) v1(68.03,53.75) v1(68.03,52.99) v1(68.03,52.23) v1(68,38.46) v1(68,37.7) v1(68,36.94) v1(68,36.17) v1(68,35.41) v1(67.98,34.64) v1(67.98,33.88) v1(67.98,33.11) v1(67.98,32.35) v1(67.98,31.59) v1(68.74,34.64) v1(68.74,33.88) v1(68.74,33.11) v1(68.74,32.35) v1(68.74,31.59) v1(68.79,59.08) v1(68.79,58.32) v1(68.79,57.56) v1(68.79,56.8) v1(68.79,56.04) v1(68.79,55.27) v1(68.79,54.51) v1(68.79,53.75) v1(68.79,52.99) v1(68.79,52.23) v1(68.77,38.46) v1(68.77,37.7) v1(68.77,36.94) v1(68.77,36.17) v1(68.77,35.41) v1(69.52,38.51) v1(69.52,37.75) v1(69.52,36.98) v1(69.52,36.22) v1(69.52,35.46) v1(69.54,34.66) v1(69.54,33.9) v1(69.54,33.14) v1(69.54,32.38) v1(69.54,31.61) v1(69.55,59.08) v1(69.55,58.32) v1(69.55,57.56) v1(69.55,56.8) v1(69.55,56.04) v1(69.55,55.27) v1(69.55,54.51) v1(69.55,53.75) v1(69.55,52.99) v1(69.55,52.23) v1(70.31,59.08) v1(70.31,58.32) v1(70.31,57.56) v1(70.31,56.8) v1(70.31,56.04) v1(70.31,55.27) v1(70.31,54.51) v1(70.31,53.75) v1(70.31,52.99) v1(70.31,52.23) v1(70.28,38.51) v1(70.28,37.75) v1(70.28,36.98) v1(70.28,36.22) v1(70.28,35.46) v1(70.3,34.66) v1(70.3,33.9) v1(70.3,33.14) v1(70.3,32.38) v1(70.3,31.61) v1(71.04,38.51) v1(71.04,37.75) v1(71.04,36.98) v1(71.04,36.22) v1(71.04,35.46) v1(71.07,34.66) v1(71.07,33.9) v1(71.07,33.14) v1(71.07,32.38) v1(71.07,31.61) v1(71.2,59.08) v1(71.2,58.32) v1(71.2,57.56) v1(71.2,56.8) v1(71.2,56.04) v1(71.19,55.27) v1(71.19,54.51) v1(71.19,53.75) v1(71.19,52.99) v1(71.19,52.23) v1(71.96,59.08) v1(71.96,58.32) v1(71.96,57.56) v1(71.96,56.8) v1(71.96,56.04) v1(71.96,55.27) v1(71.96,54.51) v1(71.96,53.75) v1(71.96,52.99) v1(71.96,52.23) v1(72.73,59.08) v1(72.73,58.32) v1(72.73,57.56) v1(72.73,56.8) v1(72.73,56.04) v1(72.72,55.27) v1(72.72,54.51) v1(72.72,53.75) v1(72.72,52.99) v1(72.72,52.23) v1(73.49,59.08) v1(73.49,58.32) v1(73.49,57.56) v1(73.49,56.8) v1(73.49,56.04) v1(73.48,55.27) v1(73.48,54.51) v1(73.48,53.75) v1(73.48,52.99) v1(73.48,52.23) v1(74.24,55.27) v1(74.24,54.51) v1(74.24,53.75) v1(74.24,52.99) v1(74.24,52.23) v1(74.25,59.08) v1(74.25,58.32) v1(74.25,57.56) v1(74.25,56.8) v1(74.25,56.04) v1(75.01,59.08) v1(75.01,58.32) v1(75.01,57.56) v1(75.01,56.8) v1(75.01,56.04) v1(75.01,55.27) v1(75.01,54.51) v1(75.01,53.75) v1(75.01,52.99) v1(75.01,52.23) v1(75.77,59.08) v1(75.77,58.32) v1(75.77,57.56) v1(75.77,56.8) v1(75.77,56.04) v1(75.77,55.27) v1(75.77,54.51) v1(75.77,53.75) v1(75.77,52.99) v1(75.77,52.23) v1(76.54,59.08) v1(76.54,58.32) v1(76.54,57.56) v1(76.54,56.8) v1(76.54,56.04) v1(76.54,55.27) v1(76.54,54.51) v1(76.54,53.75) v1(76.54,52.99) v1(76.54,52.23) v1(77.3,59.08) v1(77.3,58.32) v1(77.3,57.56) v1(77.3,56.8) v1(77.3,56.04) v1(77.3,55.27) v1(77.3,54.51) v1(77.3,53.75) v1(77.3,52.99) v1(77.3,52.23) v1(78.06,59.08) v1(78.06,58.32) v1(78.06,57.56) v1(78.06,56.8) v1(78.06,56.04) v1(78.06,55.27) v1(78.06,54.51) v1(78.06,53.75) v1(78.06,52.99) v1(78.06,52.23) v1(82.59,11.37) v1(82.59,10.61) v1(82.59,9.85) v1(82.59,9.09) v1(82.59,8.33) v1(83.35,11.37) v1(83.35,10.61) v1(83.35,9.85) v1(83.35,9.09) v1(83.35,8.33) v1(83.44,12.28) v1(83.44,7.33) v1(84.11,11.37) v1(84.11,10.61) v1(84.11,9.85) v1(84.11,9.09) v1(84.11,8.33)
VBAT+: length 53
  Top Layer w0.508: v1(29.67,22.25) 28.48,22.25 D5.2 ; v1(67.77,14.76) R146.1
  Bottom Layer w0.508: v1(29.67,22.25) 62.06,22.25 66.25,18.06 66.25,16.28 v1(67.77,14.76) ; 25.35,25.05 26.37,26.06 R154.2 ; U30.4 22.44,25.68
  vias: v1(15.93,24.14) v1(15.93,23.38) v1(16.69,24.14) v1(16.69,23.38) v1(17.45,24.14) v1(17.45,23.38) v1(18.27,24.17) v1(18.27,23.41) v1(19.03,24.17) v1(19.03,23.41) v1(19.79,24.17) v1(19.79,23.41) v1(20.58,24.18) v1(20.58,23.41) v1(21.35,24.18) v1(21.35,23.41) v1(22.11,24.18) v1(22.11,23.41) v1(22.92,24.21) v1(22.92,23.45) v1(23.68,24.21) v1(23.68,23.45) v1(24.45,24.21) v1(24.45,23.45)
VBAT-: length 70.5
  Top Layer w0.508: R136.1 7.48,13.49 7.48,14.09 6.69,14.89 5.54,14.89 4.89,15.54 R155.2 ; R147.1 v1(67.77,13.11)
  Bottom Layer w0.508: 8.42,19.75 9.78,21.11 61.04,21.11 65.11,17.05 65.11,15.78 v1(67.77,13.11)
VCC_1.65V_OPAMP: length 7.4
  Top Layer w0.254: 78.44,15.24 U31.8
  Top Layer w0.508: 79.7,29.95 v1(79.7,29.24) ; 4.89,8.08 v1(4.89,6.89) ; 4.46,30.43 v1(4.46,29.49) ; 80.09,13.36 79.52,13.94 C181.2 v1(78.44,14.65) v1(78.44,15.92) 78.44,16.51 78.42,16.54
VCC_3.3V: length 18.6
  Top Layer w0.254: R14.1 v1(51.26,3.33) R15.1 ; U4.24 v1(64,15.35) 65,15.35 65.61,15.97 ; L2.1 v1(68.23,7.14) 69.1,7.14 ; C170.2 v1(55.07,7.39) 55.5,7.39 55.75,7.65 U4.1 55.75,9.38 55.28,9.85 U4.48 ; C171.2 55.75,18.48 v1(55.75,18.04) U4.36 ; 69.1,18.06 v1(67.9,18.06) ; R13.2 v1(62.45,4.35)
  Top Layer w0.508: CN1.4 v1(37.29,5.27)
  vias: v1(45.3,9.57) v1(45.3,8.81) v1(46.06,9.57) v1(46.06,8.81) v1(46.82,9.57) v1(46.82,8.81) v1(47.59,9.57) v1(47.59,8.81) v1(48.35,9.57) v1(48.35,8.81)
VCC_3.3V_OPAMP: length 17
  Top Layer w0.508: v1(72.88,19.08) 71.96,19.08 71.33,19.71 C176.2 L3.2 ; R123.1 v1(83.39,16.54)
  Bottom Layer w0.508: v1(72.88,19.08) 74.38,19.08 76.03,17.43 82.5,17.43 v1(83.39,16.54)
VCC_5V: length 7.6
  Top Layer w0.508: 76.04,30.17 76.03,30.16 v1(76.03,29.62) ; U26.5 v1(4.4,11.85) ; v1(40.24,5.24) 40.85,4.63 U5.4 ; v1(68.53,1.3) 68.53,1.74 C54.1 69.36,2.57 U10.3 ; U27.5 v1(4.02,34.2)
  vias: v1(34.89,9.61) v1(34.89,8.85) v1(34.89,8.09) v1(35.65,9.61) v1(35.65,8.85) v1(35.65,8.09) v1(36.41,9.61) v1(36.41,8.85) v1(36.41,8.09) v1(37.17,9.61) v1(37.17,8.85) v1(37.17,8.09) v1(37.93,9.61) v1(37.93,8.85) v1(37.93,8.09)
VCC_9.5V:
  vias: v1(29.16,10.32) v1(29.16,9.55) v1(29.16,8.79) v1(29.16,8.03) v1(29.93,10.32) v1(29.93,9.55) v1(29.93,8.79) v1(29.93,8.03) v1(30.69,10.32) v1(30.69,9.55) v1(31.45,10.32) v1(31.45,9.55) v1(32.21,10.32) v1(32.21,9.55) v1(32.21,8.79) v1(32.21,8.03) v1(33.23,15.9) v1(33.23,15.14) v1(33.23,14.38) v1(33.23,13.62) v1(33.99,15.9) v1(33.99,15.14) v1(33.99,14.38) v1(33.99,13.62) v1(34.75,15.9) v1(34.75,15.14) v1(34.75,14.38) v1(34.75,13.62) v1(40.72,38.64) v1(40.72,37.88) v1(40.72,37.12) v1(41.48,38.64) v1(42.24,38.64) v1(43.52,16.16) v1(43.52,15.4) v1(43.52,14.63) v1(43.52,13.87) v1(44.28,16.16) v1(44.28,15.4) v1(44.28,14.63) v1(44.28,13.87) v1(45.04,16.16) v1(45.04,15.4) v1(45.04,14.63) v1(45.04,13.87) v1(49.87,38.76) v1(49.87,38) v1(49.87,37.24) v1(50.63,38.76) v1(51.39,38.76)
VDDA: length 7.4
  Top Layer w0.254: U4.9 59.75,7.29 60.03,7.01 65.8,7.01 L2.2
BOOT0: length 4.3
  Top Layer w0.254: R16.2 52.53,9.67 52.53,11.08 53.31,11.85 U4.44
CAN-H: length 12.7
  Top Layer w0.254: U10.7 77.68,3.84 78.06,3.46 78.24,3.46 78.44,3.66 78.44,5.62 76.38,7.67 76.38,9.34 77.05,10.01 77.64,10.01 R150.2 78.7,10.05 79.06,10.05 79.45,10.43 U11.2
CAN-L: length 12.7
  Top Layer w0.254: U11.1 79.45,9.18 79.06,9.57 78.7,9.57 R150.1 77.64,9.6 77.22,9.6 76.79,9.17 76.79,7.84 78.85,5.78 78.85,3.49 78.36,3 77.98,3 77.55,2.57 U10.6
CAN_RX(PA11): length 34
  Top Layer w0.254: v1(57.99,19.97) 58.38,19.59 58.38,18.44 57.75,17.82 U4.32 ; v1(70.06,1.3) U10.4
  Bottom Layer w0.254: v1(70.06,1.3) 70.06,2.64 71.07,3.65 71.07,5.11 70.44,5.74 65.61,5.74 62.82,8.54 62.82,17.94 60.79,19.97 v1(57.99,19.97)
CAN_TX(PA12): length 27.5
  Top Layer w0.254: U4.33 57.25,17.96 57.74,18.44 v1(57.74,19.08) ; v1(69.81,5.11) U10.1
  Bottom Layer w0.254: v1(69.81,5.11) 65.23,5.11 62.06,8.28 62.06,17.55 60.53,19.08 v1(57.74,19.08)
HO_1: length 25.6
  Top Layer w0.508: R2.2 25.74,46.38 v1(25.23,46.38) ; v1(36.15,35.59) 36.61,35.59 37.37,36.35 U2.3
  Bottom Layer w0.508: v1(36.15,35.59) 26.12,35.59 25.23,36.48 v1(25.23,46.38)
HO_2: length 30.7
  Top Layer w0.508: U3.3 46.52,36.52 47.2,35.84 v1(47.96,35.84) ; v1(53.68,46.89) R6.2
  Bottom Layer w0.508: v1(53.68,46.89) 58.38,46.89 59.65,45.62 59.65,37.87 57.61,35.84 v1(47.96,35.84)
HRTIM1_CHA1: length 33.3
  Top Layer w0.254: v1(42.5,30) 46.31,26.19 53.8,26.19 59.25,20.74 U4.29 ; U2.5 36.1,31.22 37.07,30.25 v1(37.16,30.25)
  Bottom Layer w0.254: v1(37.16,30.25) 38.05,31.14 41.36,31.14 v1(42.5,30)
HRTIM1_CHA2: length 30.3
  Top Layer w0.254: U4.30 58.75,20.48 53.68,25.56 45.93,25.56 v1(42.5,28.98) ; U2.6 37.37,31.27 37.67,30.98 38.09,30.98 38.59,30.48
  Bottom Layer w0.254: v1(38.83,30.25) 41.23,30.25 v1(42.5,28.98)
HRTIM1_CHD1: length 25.6
  Top Layer w0.254: U4.27 60.25,21.39 v1(52.79,28.86) ; R12.2 46.31,30.26 45.25,31.32 U3.5
  Bottom Layer w0.254: v1(52.79,28.86) 50.25,31.4 47.49,31.4 v1(46.35,30.25)
HRTIM1_CHD2: length 22.9
  Top Layer w0.254: U4.28 59.75,21 v1(52.91,27.84) ; U3.6 46.52,31.19 46.69,31.02 47.33,31.02 47.97,30.37 v1(47.97,30.25)
  Bottom Layer w0.254: v1(47.97,30.25) 50.5,30.25 v1(52.91,27.84)
I_BAT_DETC(PB12): length 74.6
  Top Layer w0.254: v1(61.17,14.63) 61.25,14.72 U4.25
  Top Layer w0.508: v1(1.73,10.95) 2.35,11.57 C184.2 R137.2
  Bottom Layer w0.508: v1(1.73,10.95) 1.73,10.19 2.88,9.05 6.94,9.05 13.42,2.57 48.09,2.57 58.76,13.24 60.41,13.24 61.17,14 v1(61.17,14.63)
I_CAP_DETC(PB2): length 28.4
  Top Layer w0.254: U4.20 64.58,13.35 v1(64.58,13.35)
  Top Layer w0.508: 76.16,28.28 C182.2 ; 76.16,28.28 76.16,28.27 v1(76.16,26.95) ; 76.16,28.28 77.74,28.28
  Bottom Layer w0.508: v1(64.58,13.35) 65.3,13.35 66.56,12.09 70.57,12.09 71.71,13.24 71.71,22.51 v1(76.16,26.95)
I_CHASSIS_DETC(PB13): length 92.1
  Top Layer w0.254: v1(59.9,14.51) 60.75,15.36 U4.26
  Top Layer w0.508: v1(2.88,33.3) 2.88,34.19 C177.2 R110.2
  Bottom Layer w0.508: v1(2.88,33.3) 2.88,29.75 4.02,28.6 4.02,14.63 3,13.62 3,11.46 4.15,10.32 8.12,10.32 14.09,4.35 46.94,4.35 57.1,14.51 v1(59.9,14.51)
LED_TEST: length 4.9
  Top Layer w0.254: LED1.1 53.13,5.71 53.68,6.25 55.2,6.25 56.25,7.3 U4.2
LO_1: length 18.6
  Top Layer w0.508: U2.8 39.91,33.6 39.32,34.19 v1(38.69,34.19) ; v1(24.72,32.54) R4.2
  Bottom Layer w0.508: v1(38.69,34.19) 35.51,34.19 33.86,32.54 v1(24.72,32.54)
LO_2: length 5.5
  Top Layer w0.508: U3.8 54.17,32.39 R8.2
NRST: length 14.1
  Top Layer w0.254: U4.7 58.75,7.14 59.39,6.51 62.81,6.51 R13.1 65.81,5.36 C19.1 65.87,4.22 65.49,3.84 64.21,3.84 SW1.2
OSC_IN: length 8
  Top Layer w0.254: U4.5 57.75,6.2 C17.1 57.99,4.28 57.99,2.57 57.03,1.6 X2.1
OSC_OUT: length 5.4
  Top Layer w0.254: 59.14,5.36 C18.1 ; 59.14,5.36 58.25,6.25 U4.6 ; 59.14,5.36 59.12,5.35 X2.3
SW1: length 13.8
  Top Layer w0.508: U2.4 36.1,40.39 C2.1 36.34,44.42 34.32,46.43 L1.1
  vias: v1(27.24,45.08) v1(27.24,44.31) v1(27.24,43.55) v1(27.24,42.79) v1(27.24,42.03) v1(27.26,41.29) v1(27.26,40.52) v1(27.26,39.76) v1(27.26,39) v1(27.26,38.24) v1(28,45.1) v1(28,44.34) v1(28,43.58) v1(28,42.82) v1(28,42.06) v1(28.01,41.31) v1(28.01,40.55) v1(28.01,39.79) v1(28.01,39.03) v1(28.01,38.27) v1(28.76,45.1) v1(28.76,44.34) v1(28.76,43.58) v1(28.76,42.82) v1(28.76,42.06) v1(28.78,41.31) v1(28.78,40.55) v1(28.78,39.79) v1(28.78,39.03) v1(28.78,38.27) v1(29.52,45.1) v1(29.52,44.34) v1(29.52,43.58) v1(29.52,42.82) v1(29.52,42.06) v1(29.54,41.31) v1(29.54,40.55) v1(29.54,39.79) v1(29.54,39.03) v1(29.54,38.27) v1(30.35,41.4) v1(30.35,40.64) v1(30.35,39.88) v1(30.35,39.11) v1(30.35,38.35) v1(31.11,41.4) v1(31.11,40.64) v1(31.11,39.88) v1(31.11,39.11) v1(31.11,38.35) v1(31.87,41.4) v1(31.87,40.64) v1(31.87,39.88) v1(31.87,39.11) v1(31.87,38.35) v1(32.47,58.94) v1(32.47,58.18) v1(32.47,57.42) v1(32.47,56.66) v1(32.47,55.89) v1(32.47,55.13) v1(32.47,54.37) v1(32.47,53.61) v1(32.47,52.85) v1(32.47,52.08) v1(32.48,51.3) v1(32.48,50.54) v1(32.48,49.78) v1(32.48,49.02) v1(32.48,48.25) v1(32.48,47.46) v1(32.48,46.7) v1(32.48,45.94) v1(32.48,45.18) v1(32.48,44.42) v1(32.63,41.43) v1(32.63,40.66) v1(32.63,39.9) v1(32.63,39.14) v1(32.63,38.38) v1(33.23,58.94) v1(33.23,58.18) v1(33.23,57.42) v1(33.23,56.66) v1(33.23,55.89) v1(33.23,55.13) v1(33.23,54.37) v1(33.23,53.61) v1(33.23,52.85) v1(33.23,52.08) v1(33.24,51.3) v1(33.24,50.54) v1(33.24,49.78) v1(33.24,49.02) v1(33.24,48.25) v1(33.24,47.46) v1(33.24,46.7) v1(33.24,45.94) v1(33.24,45.18) v1(33.24,44.42) v1(33.39,41.43) v1(33.39,40.66) v1(33.39,39.9) v1(33.39,39.14) v1(33.39,38.38) v1(33.99,58.94) v1(33.99,58.18) v1(33.99,57.42) v1(33.99,56.66) v1(33.99,55.89) v1(33.99,55.13) v1(33.99,54.37) v1(33.99,53.61) v1(33.99,52.85) v1(33.99,52.08) v1(34,51.3) v1(34,50.54) v1(34,49.78) v1(34,49.02) v1(34,48.25) v1(34,47.46) v1(34,46.7) v1(34,45.94) v1(34,45.18) v1(34,44.42) v1(34.15,41.43) v1(34.15,40.66) v1(34.15,39.9) v1(34.15,39.14) v1(34.15,38.38) v1(34.75,58.97) v1(34.75,58.21) v1(34.75,57.45) v1(34.75,56.68) v1(34.75,55.92) v1(34.75,55.16) v1(34.75,54.4) v1(34.75,53.64) v1(34.75,52.87) v1(34.75,52.11) v1(34.76,51.33) v1(34.76,50.57) v1(34.76,49.8) v1(34.76,49.04) v1(34.76,48.28) v1(34.76,47.49) v1(34.76,46.73) v1(34.76,45.97) v1(34.76,45.2) v1(34.76,44.44) v1(35.51,58.97) v1(35.51,58.21) v1(35.51,57.45) v1(35.51,56.68) v1(35.51,55.92) v1(35.51,55.16) v1(35.51,54.4) v1(35.51,53.64) v1(35.51,52.87) v1(35.51,52.11) v1(35.52,51.33) v1(35.52,50.57) v1(35.52,49.8) v1(35.52,49.04) v1(35.52,48.28) v1(35.52,47.49) v1(35.52,46.73) v1(35.52,45.97) v1(35.52,45.2) v1(35.52,44.44) v1(36.27,58.97) v1(36.27,58.21) v1(36.27,57.45) v1(36.27,56.68) v1(36.27,55.92) v1(36.27,55.16) v1(36.27,54.4) v1(36.27,53.64) v1(36.27,52.87) v1(36.27,52.11) v1(36.28,51.33) v1(36.28,50.57) v1(36.28,49.8) v1(36.28,49.04) v1(36.28,48.28) v1(36.28,47.49) v1(36.28,46.73) v1(36.28,45.97) v1(36.28,45.2) v1(36.28,44.44)
SW2: length 15.6
  Top Layer w0.508: L1.2 50.68,46.56 47.71,43.59 46.94,43.59 45.44,42.08 C16.1 45.25,40.6 U3.4
  vias: v1(48.44,59.01) v1(48.44,58.25) v1(48.44,57.49) v1(48.44,56.72) v1(48.44,55.96) v1(48.44,51.37) v1(48.44,50.6) v1(48.44,49.84) v1(48.44,49.08) v1(48.44,48.32) v1(48.46,55.21) v1(48.46,54.45) v1(48.46,53.69) v1(48.46,52.93) v1(48.46,52.16) v1(48.46,47.52) v1(48.46,46.76) v1(48.46,46) v1(48.46,45.23) v1(48.46,44.47) v1(49.2,59.01) v1(49.2,58.25) v1(49.2,57.49) v1(49.2,56.72) v1(49.2,55.96) v1(49.22,55.21) v1(49.22,54.45) v1(49.22,53.69) v1(49.22,52.93) v1(49.22,52.16) v1(49.2,51.37) v1(49.2,50.6) v1(49.2,49.84) v1(49.2,49.08) v1(49.2,48.32) v1(49.22,47.52) v1(49.22,46.76) v1(49.22,46) v1(49.22,45.23) v1(49.22,44.47) v1(49.96,59.01) v1(49.96,58.25) v1(49.96,57.49) v1(49.96,56.72) v1(49.96,55.96) v1(49.99,55.21) v1(49.99,54.45) v1(49.99,53.69) v1(49.99,52.93) v1(49.99,52.16) v1(49.96,51.37) v1(49.96,50.6) v1(49.96,49.84) v1(49.96,49.08) v1(49.96,48.32) v1(49.99,47.52) v1(49.99,46.76) v1(49.99,46) v1(49.99,45.23) v1(49.99,44.47) v1(50.72,59.04) v1(50.72,58.27) v1(50.72,57.51) v1(50.72,56.75) v1(50.72,55.99) v1(50.74,55.24) v1(50.74,54.48) v1(50.74,53.71) v1(50.74,52.95) v1(50.74,52.19) v1(50.72,51.39) v1(50.72,50.63) v1(50.72,49.87) v1(50.72,49.11) v1(50.72,48.34) v1(50.74,47.55) v1(50.74,46.78) v1(50.74,46.02) v1(50.74,45.26) v1(50.74,44.5) v1(51.48,59.04) v1(51.48,58.27) v1(51.48,57.51) v1(51.48,56.75) v1(51.48,55.99) v1(51.5,55.24) v1(51.5,54.48) v1(51.5,53.71) v1(51.5,52.95) v1(51.5,52.19) v1(51.48,51.39) v1(51.48,50.63) v1(51.48,49.87) v1(51.48,49.11) v1(51.48,48.34) v1(51.5,47.55) v1(51.5,46.78) v1(51.5,46.02) v1(51.5,45.26) v1(51.5,44.5) v1(52.24,59.04) v1(52.24,58.27) v1(52.24,57.51) v1(52.24,56.75) v1(52.24,55.99) v1(52.24,51.39) v1(52.24,50.63) v1(52.24,49.87) v1(52.24,49.11) v1(52.24,48.34) v1(52.26,55.24) v1(52.26,54.48) v1(52.26,53.71) v1(52.26,52.95) v1(52.26,52.19) v1(52.26,47.55) v1(52.26,46.78) v1(52.26,46.02) v1(52.26,45.26) v1(52.26,44.5) v1(53.05,45.17) v1(53.05,44.41) v1(53.05,43.65) v1(53.05,42.89) v1(53.05,42.13) v1(53.1,41.42) v1(53.1,40.65) v1(53.1,39.89) v1(53.1,39.13) v1(53.1,38.37) v1(53.81,45.17) v1(53.81,44.41) v1(53.81,43.65) v1(53.81,42.89) v1(53.81,42.13) v1(53.86,41.42) v1(53.86,40.65) v1(53.86,39.89) v1(53.86,39.13) v1(53.86,38.37) v1(54.57,45.17) v1(54.57,44.41) v1(54.57,43.65) v1(54.57,42.89) v1(54.57,42.13) v1(54.62,41.42) v1(54.62,40.65) v1(54.62,39.89) v1(54.62,39.13) v1(54.62,38.37) v1(55.33,45.2) v1(55.33,44.44) v1(55.33,43.68) v1(55.33,42.91) v1(55.33,42.15) v1(55.38,41.44) v1(55.38,40.68) v1(55.38,39.92) v1(55.38,39.16) v1(55.38,38.39) v1(56.09,45.2) v1(56.09,44.44) v1(56.09,43.68) v1(56.09,42.91) v1(56.09,42.15) v1(56.14,41.44) v1(56.14,40.68) v1(56.14,39.92) v1(56.14,39.16) v1(56.14,38.39) v1(56.85,45.2) v1(56.85,44.44) v1(56.85,43.68) v1(56.85,42.91) v1(56.85,42.15) v1(56.9,41.44) v1(56.9,40.68) v1(56.9,39.92) v1(56.9,39.16) v1(56.9,38.39)
SWCLK: length 28.1
  Top Layer w0.254: U4.37 53.25,15.35 49.63,11.73 49.63,7.54 48.85,6.76 33.99,6.76 33.24,6.01 CN1.2
SWDIO: length 32.9
  Top Layer w0.254: U4.34 56.75,16.06 56.47,15.78 53.04,15.78 49.11,11.84 49.11,7.65 48.72,7.27 33.23,7.27 31.99,6.03 CN1.1
USART2_RX: length 15.2
  Top Layer w0.254: U5.1 45.77,5.46 46.18,5.87 49.53,5.87 50.63,6.97 50.63,11.08 53.4,13.85 U4.40
USART2_TX: length 16.6
  Top Layer w0.254: U4.39 53,14.35 50.12,11.48 50.12,7.39 48.98,6.25 45.29,6.25 44.52,5.48 U5.2
V_BAT_DETC(PA3): length 13.4
  Top Layer w0.254: v1(64.34,8.92) 63.41,9.85 U4.13
  Top Layer w0.508: v1(70.5,8.41) C194.2 72.85,11.9 R149.2
  Bottom Layer w0.508: v1(64.34,8.92) 64.85,8.41 v1(70.5,8.41)
V_CAP_DETC(PB0): length 32.5
  Top Layer w0.254: v1(64.6,10.32) 64.56,10.35 62.75,10.35
  Top Layer w0.508: v1(76.41,12.09) 76.41,23.9 R122.1 79.21,26.7 80.79,26.7
  Bottom Layer w0.508: v1(64.6,10.32) 65.23,9.68 74.38,9.68 76.41,11.71 v1(76.41,12.09)
V_CHASIS_DETC(PA4): length 31.4
  Top Layer w0.254: 62.75,12.35 64.21,12.35 v1(64.22,12.35)
  Top Layer w0.508: C178.2 70.69,28.1 R117.1 74.88,23.9 v1(74.88,12.22)
  Bottom Layer w0.508: v1(74.88,12.22) 74.88,11.71 74,10.82 65.74,10.82 v1(64.22,12.35)
VCAP+: length 77.3
  Top Layer w0.508: v1(32.09,26.44) 32.09,26.39 D6.2 ; v1(82.17,44.81) 83.52,43.46 83.52,42.19 v1(82.12,40.8) ; v1(83.52,19.84) R118.1
  Bottom Layer w0.508: v1(32.09,26.44) 32.59,26.95 58.63,26.95 62.19,30.51 62.19,39.53 64.47,41.81 ; v1(82.12,40.8) 82.12,32.79 84.41,30.51 84.41,20.73 v1(83.52,19.84) ; v1(82.17,44.81) R152.2
  vias: v1(56.22,59.34) v1(56.22,58.58) v1(56.22,57.81) v1(56.22,57.05) v1(56.22,56.29) v1(56.22,55.53) v1(56.22,54.77) v1(56.22,54) v1(56.22,53.24) v1(56.22,52.48) v1(56.98,59.34) v1(56.98,58.58) v1(56.98,57.81) v1(56.98,57.05) v1(56.98,56.29) v1(56.98,55.53) v1(56.98,54.77) v1(56.98,54) v1(56.98,53.24) v1(56.98,52.48) v1(57.74,59.34) v1(57.74,58.58) v1(57.74,57.81) v1(57.74,57.05) v1(57.74,56.29) v1(57.74,55.53) v1(57.74,54.77) v1(57.74,54) v1(57.74,53.24) v1(57.74,52.48) v1(58.5,59.34) v1(58.5,58.58) v1(58.5,57.81) v1(58.5,57.05) v1(58.5,56.29) v1(58.5,55.53) v1(58.5,54.77) v1(58.5,54) v1(58.5,53.24) v1(58.5,52.48) v1(59.26,59.34) v1(59.26,58.58) v1(59.26,57.81) v1(59.26,57.05) v1(59.26,56.29) v1(59.26,55.53) v1(59.26,54.77) v1(59.26,54) v1(59.26,53.24) v1(59.26,52.48) v1(60.15,54.38) v1(60.15,53.62) v1(60.15,52.86) v1(60.15,52.1) v1(60.91,53.62) v1(60.91,52.86) v1(60.91,52.1) v1(60.91,51.34) v1(61.68,52.86) v1(61.68,52.1) v1(61.68,51.34) v1(61.68,50.57) v1(62.44,52.1) v1(62.44,51.34) v1(62.44,50.57) v1(62.44,49.81) v1(63.2,51.34) v1(63.2,50.57) v1(63.2,49.81) v1(63.2,49.05) v1(63.2,48.29) v1(63.2,47.53) v1(63.22,46.75) v1(63.22,45.99) v1(63.22,45.23) v1(63.22,44.46) v1(63.22,43.7) v1(63.22,42.9) v1(63.22,42.14) v1(63.22,41.38) v1(63.22,40.62) v1(63.22,39.86) v1(64,50.57) v1(63.96,49.81) v1(64,49.05) v1(64,48.28) v1(64,47.52) v1(63.98,46.75) v1(63.98,45.99) v1(63.98,45.23) v1(63.98,44.46) v1(63.98,43.7) v1(63.98,42.9) v1(63.98,42.14) v1(63.98,41.38) v1(63.98,40.62) v1(63.98,39.86) v1(64.75,46.75) v1(64.75,45.99) v1(64.75,45.23) v1(64.75,44.46) v1(64.75,43.7) v1(64.75,42.9) v1(64.75,42.14) v1(64.75,41.38) v1(64.75,40.62) v1(64.75,39.86) v1(64.76,50.57) v1(64.76,49.81) v1(64.76,49.05) v1(64.76,48.28) v1(64.76,47.52) v1(65.52,50.57) v1(65.52,49.81) v1(65.52,49.05) v1(65.52,48.28) v1(65.52,47.52) v1(65.51,46.75) v1(65.51,45.99) v1(65.51,45.23) v1(65.51,44.46) v1(65.51,43.7) v1(65.51,42.9) v1(65.51,42.14) v1(65.51,41.38) v1(65.51,40.62) v1(65.51,39.86) v1(66.28,50.57) v1(66.28,49.81) v1(66.28,49.05) v1(66.28,48.28) v1(66.28,47.52) v1(66.27,46.75) v1(66.27,45.99) v1(66.27,45.23) v1(66.27,44.46) v1(66.27,43.7) v1(66.27,42.9) v1(66.27,42.14) v1(66.27,41.38) v1(66.27,40.62) v1(66.27,39.86) v1(67.04,50.57) v1(67.04,49.81) v1(67.04,49.05) v1(67.04,48.28) v1(67.04,47.52) v1(66.97,46.73) v1(66.97,45.96) v1(66.97,45.2) v1(66.97,44.44) v1(66.97,43.68) v1(66.97,42.93) v1(66.97,42.17) v1(66.97,41.4) v1(66.97,40.64) v1(66.97,39.88) v1(67.73,46.73) v1(67.73,45.96) v1(67.73,45.2) v1(67.73,44.44) v1(67.73,43.68) v1(67.73,42.93) v1(67.73,42.17) v1(67.73,41.4) v1(67.73,40.64) v1(67.73,39.88) v1(67.77,50.57) v1(67.77,49.81) v1(67.77,49.05) v1(67.77,48.29) v1(67.77,47.53) v1(68.53,50.57) v1(68.53,49.81) v1(68.53,49.05) v1(68.53,48.29) v1(68.53,47.53) v1(68.5,46.73) v1(68.5,45.96) v1(68.5,45.2) v1(68.5,44.44) v1(68.5,43.68) v1(68.5,42.93) v1(68.5,42.17) v1(68.5,41.4) v1(68.5,40.64) v1(68.5,39.88) v1(69.3,50.57) v1(69.3,49.81) v1(69.3,49.05) v1(69.3,48.29) v1(69.3,47.53) v1(69.26,46.73) v1(69.26,45.96) v1(69.26,45.2) v1(69.26,44.44) v1(69.26,43.68) v1(69.26,42.93) v1(69.26,42.17) v1(69.26,41.4) v1(69.26,40.64) v1(69.26,39.88) v1(70.02,46.73) v1(70.02,45.96) v1(70.02,45.2) v1(70.02,44.44) v1(70.02,43.68) v1(70.02,42.93) v1(70.02,42.17) v1(70.02,41.4) v1(70.02,40.64) v1(70.02,39.88) v1(70.06,50.57) v1(70.06,49.81) v1(70.06,49.05) v1(70.06,48.29) v1(70.06,47.53) v1(70.82,50.57) v1(70.82,49.81) v1(70.82,49.05) v1(70.82,48.29) v1(70.82,47.53) v1(71.58,50.57) v1(71.58,49.81) v1(71.58,49.05) v1(71.58,48.29) v1(71.58,47.53) v1(72.34,50.57) v1(72.34,49.81) v1(72.34,49.05) v1(72.34,48.29) v1(72.34,47.53) v1(73.11,50.57) v1(73.11,49.81) v1(73.11,49.05) v1(73.11,48.29) v1(73.11,47.53) v1(73.87,50.57) v1(73.87,49.81) v1(73.87,49.05) v1(73.87,48.29) v1(73.87,47.53) v1(74.63,50.57) v1(74.63,49.81) v1(74.63,49.05) v1(74.63,48.29) v1(74.63,47.53) v1(75.39,50.57) v1(75.39,49.81) v1(75.39,49.05) v1(75.39,48.29) v1(75.39,47.53) v1(76.16,50.57) v1(76.16,49.81) v1(76.16,49.05) v1(76.16,48.29) v1(76.16,47.53) v1(76.92,50.57) v1(76.92,49.81) v1(76.92,49.05) v1(76.92,48.29) v1(76.92,47.53) v1(77.68,50.57) v1(77.68,49.81) v1(77.68,49.05) v1(77.68,48.29) v1(77.68,47.53) v1(78.44,50.57) v1(78.44,49.81) v1(78.44,49.05) v1(78.44,48.29) v1(78.44,47.53)
VCAP-: length 24.5
  Top Layer w0.508: R151.1 74.85,35.28 R126.1 ; v1(83.39,23.14) R119.1
  Bottom Layer w0.508: v1(83.39,23.14) 83.39,29.37 79.97,32.79 R152.1
VCHASSIS+: length 58.3
  Top Layer w0.508: v1(67.26,21.36) R113.1
  Bottom Layer w0.508: v1(67.26,21.36) 64.72,21.36 62.69,23.4 31.45,23.4 30.05,24.79 30.05,29.11 28.53,30.64 24.09,30.64 22.82,29.37 U30.6 17.64,29.37
  vias: v1(10.77,50.56) v1(10.77,49.79) v1(10.77,49.03) v1(10.77,48.27) v1(10.77,47.51) v1(11.53,50.56) v1(11.53,49.79) v1(11.53,49.03) v1(11.53,48.27) v1(11.53,47.51) v1(12.3,50.56) v1(12.3,49.79) v1(12.3,49.03) v1(12.3,48.27) v1(12.3,47.51) v1(13.06,50.56) v1(13.06,49.79) v1(13.06,49.03) v1(13.06,48.27) v1(13.06,47.51) v1(13.82,50.56) v1(13.82,49.79) v1(13.82,49.03) v1(13.82,48.27) v1(13.82,47.51) v1(14.56,50.57) v1(14.56,49.81) v1(14.56,49.05) v1(14.56,48.29) v1(14.56,47.53) v1(14.56,46.76) v1(14.56,46) v1(14.56,45.24) v1(14.56,44.48) v1(14.56,43.72) v1(15.32,50.57) v1(15.32,49.81) v1(15.32,49.05) v1(15.32,48.29) v1(15.32,47.53) v1(15.32,46.76) v1(15.32,46) v1(15.32,45.24) v1(15.32,44.48) v1(15.32,43.72) v1(16.08,50.57) v1(16.08,49.81) v1(16.08,49.05) v1(16.08,48.29) v1(16.08,47.53) v1(16.08,46.76) v1(16.08,46) v1(16.08,45.24) v1(16.08,44.48) v1(16.08,43.72) v1(16.85,50.57) v1(16.85,49.81) v1(16.85,49.05) v1(16.85,48.29) v1(16.85,47.53) v1(16.85,46.76) v1(16.85,46) v1(16.85,45.24) v1(16.85,44.48) v1(16.85,43.72) v1(17.61,50.57) v1(17.61,49.81) v1(17.61,49.05) v1(17.61,48.29) v1(17.61,47.53) v1(17.61,46.76) v1(17.61,46) v1(17.61,45.24) v1(17.61,44.48) v1(17.61,43.72) v1(18.37,50.57) v1(18.37,49.81) v1(18.37,49.05) v1(18.37,48.29) v1(18.37,47.53) v1(18.37,46.76) v1(18.37,46) v1(18.37,45.24) v1(18.37,44.48) v1(18.37,43.72) v1(18.37,42.93) v1(18.37,42.16) v1(18.37,41.4) v1(18.37,40.64) v1(18.37,39.88) v1(19.13,50.57) v1(19.13,49.81) v1(19.13,49.05) v1(19.13,48.29) v1(19.13,47.53) v1(19.13,46.76) v1(19.13,46) v1(19.13,45.24) v1(19.13,44.48) v1(19.13,43.72) v1(19.13,42.93) v1(19.13,42.16) v1(19.13,41.4) v1(19.13,40.64) v1(19.13,39.88) v1(19.89,50.57) v1(19.89,49.81) v1(19.89,49.05) v1(19.89,48.29) v1(19.89,47.53) v1(19.89,46.76) v1(19.89,46) v1(19.89,45.24) v1(19.89,44.48) v1(19.89,43.72) v1(19.89,42.93) v1(19.89,42.16) v1(19.89,41.4) v1(19.89,40.64) v1(19.89,39.88) v1(20.66,50.57) v1(20.66,49.81) v1(20.66,49.05) v1(20.66,48.29) v1(20.66,47.53) v1(20.66,46.76) v1(20.66,46) v1(20.66,45.24) v1(20.66,44.48) v1(20.66,43.72) v1(20.66,42.93) v1(20.66,42.16) v1(20.66,41.4) v1(20.66,40.64) v1(20.66,39.88) v1(21.42,50.57) v1(21.42,49.81) v1(21.42,49.05) v1(21.42,48.29) v1(21.42,47.53) v1(21.42,46.76) v1(21.42,46) v1(21.42,45.24) v1(21.42,44.48) v1(21.42,43.72) v1(21.42,42.93) v1(21.42,42.16) v1(21.42,41.4) v1(21.42,40.64) v1(21.42,39.88) v1(22.15,43.71) v1(22.15,42.94) v1(22.15,42.18) v1(22.15,41.42) v1(22.15,40.66) v1(22.18,51.34) v1(22.18,50.57) v1(22.18,49.81) v1(22.18,49.05) v1(22.18,48.29) v1(22.16,47.5) v1(22.16,46.73) v1(22.16,45.97) v1(22.16,45.21) v1(22.16,44.45) v1(22.94,52.1) v1(22.94,51.34) v1(22.94,50.57) v1(22.94,49.81) v1(22.94,49.05) v1(22.94,48.29) v1(22.92,47.5) v1(22.92,46.73) v1(22.92,45.97) v1(22.92,45.21) v1(22.92,44.45) v1(22.91,43.71) v1(22.91,42.94) v1(22.91,42.18) v1(22.91,41.42) v1(22.91,40.66) v1(23.7,52.86) v1(23.7,52.1) v1(23.7,51.34) v1(23.7,50.57) v1(23.7,49.81) v1(23.7,49.05) v1(23.7,48.29) v1(23.69,47.5) v1(23.69,46.73) v1(23.69,45.97) v1(23.69,45.21) v1(23.69,44.45) v1(23.67,43.71) v1(23.67,42.94) v1(23.67,42.18) v1(23.67,41.42) v1(23.67,40.66) v1(24.47,53.62) v1(24.47,52.86) v1(24.47,52.1) v1(24.47,51.34) v1(24.47,50.57) v1(25.23,54.38) v1(25.23,53.62) v1(25.23,52.86) v1(25.23,52.1) v1(25.23,51.34) v1(25.99,59.08) v1(25.99,58.32) v1(25.99,57.56) v1(25.99,56.8) v1(25.99,56.04) v1(25.99,55.24) v1(25.99,54.47) v1(25.99,53.71) v1(25.99,52.95) v1(25.99,52.19) v1(26.75,59.08) v1(26.75,58.32) v1(26.75,57.56) v1(26.75,56.8) v1(26.75,56.04) v1(26.75,55.24) v1(26.75,54.47) v1(26.75,53.71) v1(26.75,52.95) v1(26.75,52.19) v1(27.51,59.08) v1(27.51,58.32) v1(27.51,57.56) v1(27.51,56.8) v1(27.51,56.04) v1(27.51,55.24) v1(27.51,54.47) v1(27.51,53.71) v1(27.51,52.95) v1(27.51,52.19) v1(28.28,59.08) v1(28.28,58.32) v1(28.28,57.56) v1(28.28,56.8) v1(28.28,56.04) v1(28.28,55.24) v1(28.28,54.47) v1(28.28,53.71) v1(28.28,52.95) v1(28.28,52.19) v1(29.04,59.08) v1(29.04,58.32) v1(29.04,57.56) v1(29.04,56.8) v1(29.04,56.04) v1(29.04,55.24) v1(29.04,54.47) v1(29.04,53.71) v1(29.04,52.95) v1(29.04,52.19)
VCHASSIS-: length 4.8
  Top Layer w0.508: R153.1 4.89,38.02 5.67,37.24 6.69,37.24 7.07,36.86 7.07,36.06 R109.1
$1N418: length 2.8
  Top Layer w0.508: U2.2 38.64,40.33 C2.2
$1N4475: length 3
  Top Layer w0.508: U3.2 47.79,40.45 C16.2
$1N6839: length 14.2
  Bottom Layer w0.254: U30.5 22.12,28.42 21.42,27.71 21.42,27.33 21.04,26.95 17.73,26.95 16.85,26.06 15.96,26.95 11.13,26.95 10.88,26.7 Q7.4
$1N6847: length 3.5
  Bottom Layer w0.254: C195.2 28.1,29.1 R154.1 26.1,29.37 U30.1
$2N2900: length 1.8
  Top Layer w0.254: R14.2 52.91,1.05 LED2.2
$2N2950: length 2.5
  Top Layer w0.254: LED1.2 53.04,4.22 52.28,4.98 51.89,4.98 R15.2
$3N664: length 3.6
  Top Layer w0.254: 5.87,31.99 5.87,32.18 6.02,32.33 7.58,32.33 ; 5.85,31.99 5.85,30.55 5.97,30.43
$3N881: length 3.6
  Top Layer w0.254: 7.58,34.02 7.44,33.88 6.08,33.88 5.86,34.11 5.86,35.59 5.99,35.72
$3N890: length 6.6
  Top Layer w0.254: 4.51,35.74 5.25,34.99 5.25,33.67 4.56,32.98 4.56,31.62 4.42,31.48 3.39,31.48 2.89,30.98
$3N1076: length 4.4
  Top Layer w0.508: R115.1 R113.2 71.57,20.35 U31.3
$3N1084: length 7
  Top Layer w0.508: U31.2 71.71,21.62 71.46,21.87 71.46,23.77 R114.2 70.56,24.81 R116.2
$3N1109: length 4.6
  Top Layer w0.508: R116.1 71.57,25.3 71.97,25.3 R117.2 72.85,22.91 U31.1
$3N1355: length 4.2
  Top Layer w0.508: R120.1 80.75,19.86 R118.2 80.09,19.84 79.58,20.35 U31.12
$3N1358: length 5.4
  Top Layer w0.508: R121.2 82.24,24.66 81.36,23.78 81.36,23.77 R119.2 80.73,23.14 79.97,22.38 79.97,22 79.58,21.62 U31.13
$3N1363: length 5
  Top Layer w0.254: 78.44,22.91 U31.14
  Top Layer w0.508: R121.1 79.97,24.02 79.97,23.4 79.48,22.91 78.44,22.91 R122.2
$3N1905: length 3.4
  Top Layer w0.254: 79.7,31.58 79.58,31.47 U25.3 78.08,31.47 77.91,31.63 77.91,33.14
$3N1918: length 3.2
  Top Layer w0.254: R126.2 76.36,31.65 76.18,31.47 ; U25.4 74.7,31.47 R128.1
$3N1923: length 6.5
  Top Layer w0.254: 78.52,30.17 78.82,29.87 78.82,28.83 R127.1 ; 78.24,30.17 77.38,30.17 76.66,30.89 75.42,30.89 R128.2
$3N2447: length 3.4
  Top Layer w0.254: R135.2 6.53,9.93 6.42,9.82 U26.3 6.42,8.1 R139.1
$3N2460: length 3.2
  Top Layer w0.254: R136.2 7.59,11.87 6.39,11.87 R138.1
$3N2465: length 6.9
  Top Layer w0.254: R137.1 3.99,8.97 4.63,8.97 5.12,9.45 U26.1 5.14,9.67 5.14,10.49 5.78,11.13 5.78,12.39 4.89,13.29
$3N2835: length 4.5
  Top Layer w0.508: R146.2 R145.2 71.96,17.81 U31.5
$3N2844: length 7.1
  Top Layer w0.508: R148.1 70.56,12.96 R147.2 71.46,14.01 71.46,15.9 72.09,16.54 72.88,16.54
$3N2855: length 4.8
  Top Layer w0.508: R148.2 71.58,12.48 71.58,12.73 72.84,13.99 R149.1 72.88,14.01 U31.7
$3N5870: length 5.9
  Top Layer w0.508: U31.10 79.71,17.81 80.09,18.19 R124.2 R123.2 80.79,16.48 80.79,14.79
$4N1271: length 8.3
  Top Layer w0.254: U18.3 24.59,15.01 23.84,14.26 R141.2 23.84,10.06 ; U19.1 25.42,10.06 23.84,10.06 ; 23.84,10.06 R140.1

## Copper pours and planes (outline as drawn; the poured copper is in the pictures)
GND on Top Layer: -6.39,64.67 92.54,64.67 92.54,-9.24 -6.39,-9.24
GND on Bottom Layer: -13.09,70.62 102.35,70.62 102.35,-12.57 -13.09,-12.57
GND on GND: 0.26,59.74 84.74,59.74 84.74,0.26 0.26,0.26
GND on VCC: 0.26,59.74 84.74,59.74 84.74,0.26 0.26,0.26
VBAT+ on Top Layer: 5.65,26.55 28.28,26.55 28.28,22.51 5.65,22.51
VBAT+ on Bottom Layer: 5.66,26.57 28.27,26.57 28.27,22.51 5.66,22.51
